# EAGLE board umod4 (EAGLE 7.6.0)
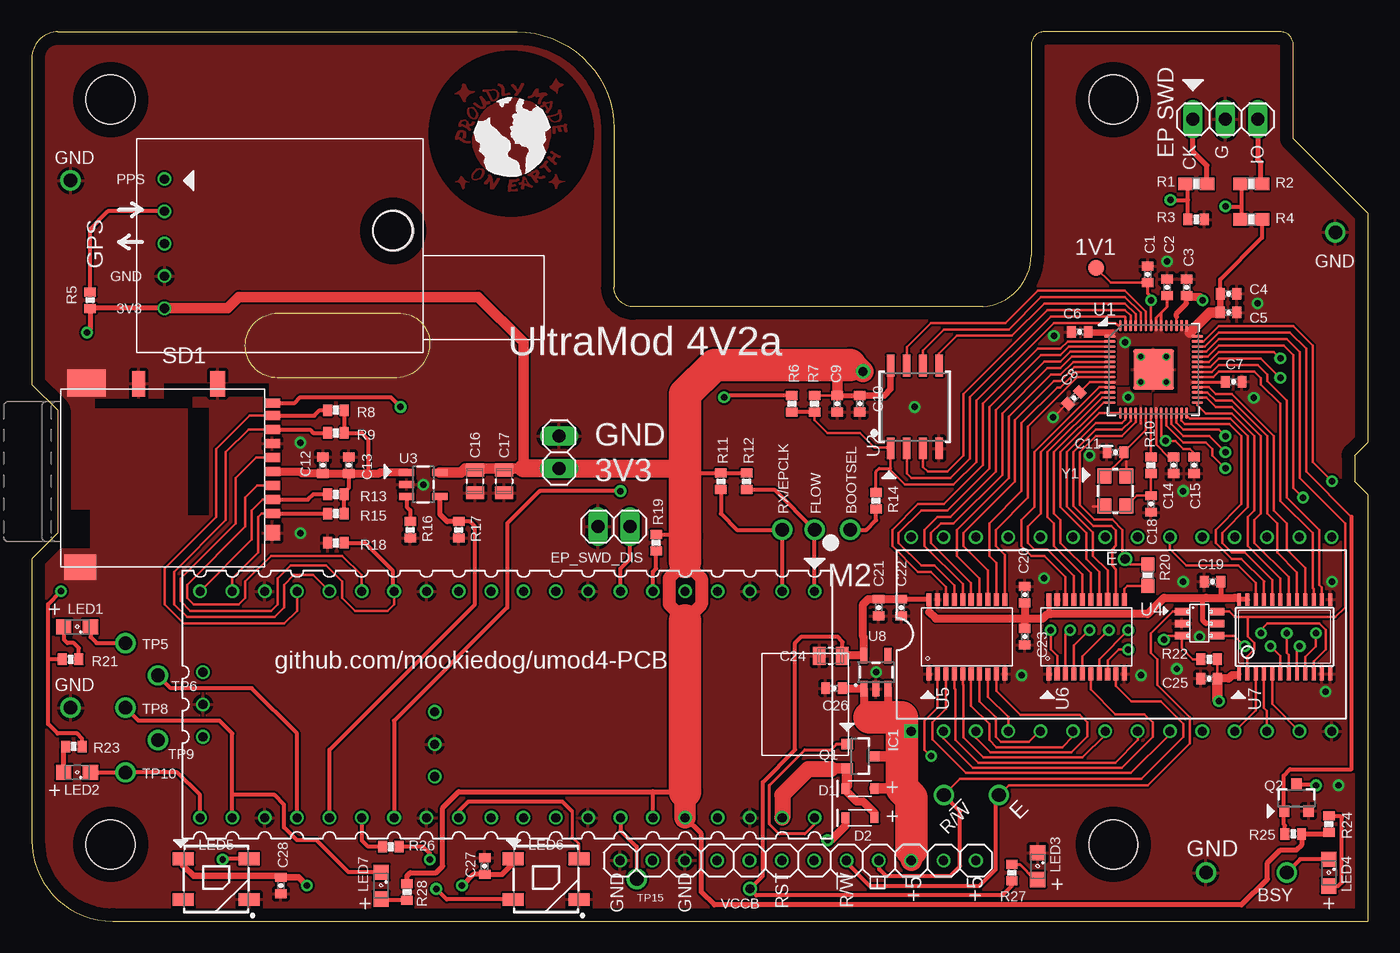
[diagram p8: board, top side]
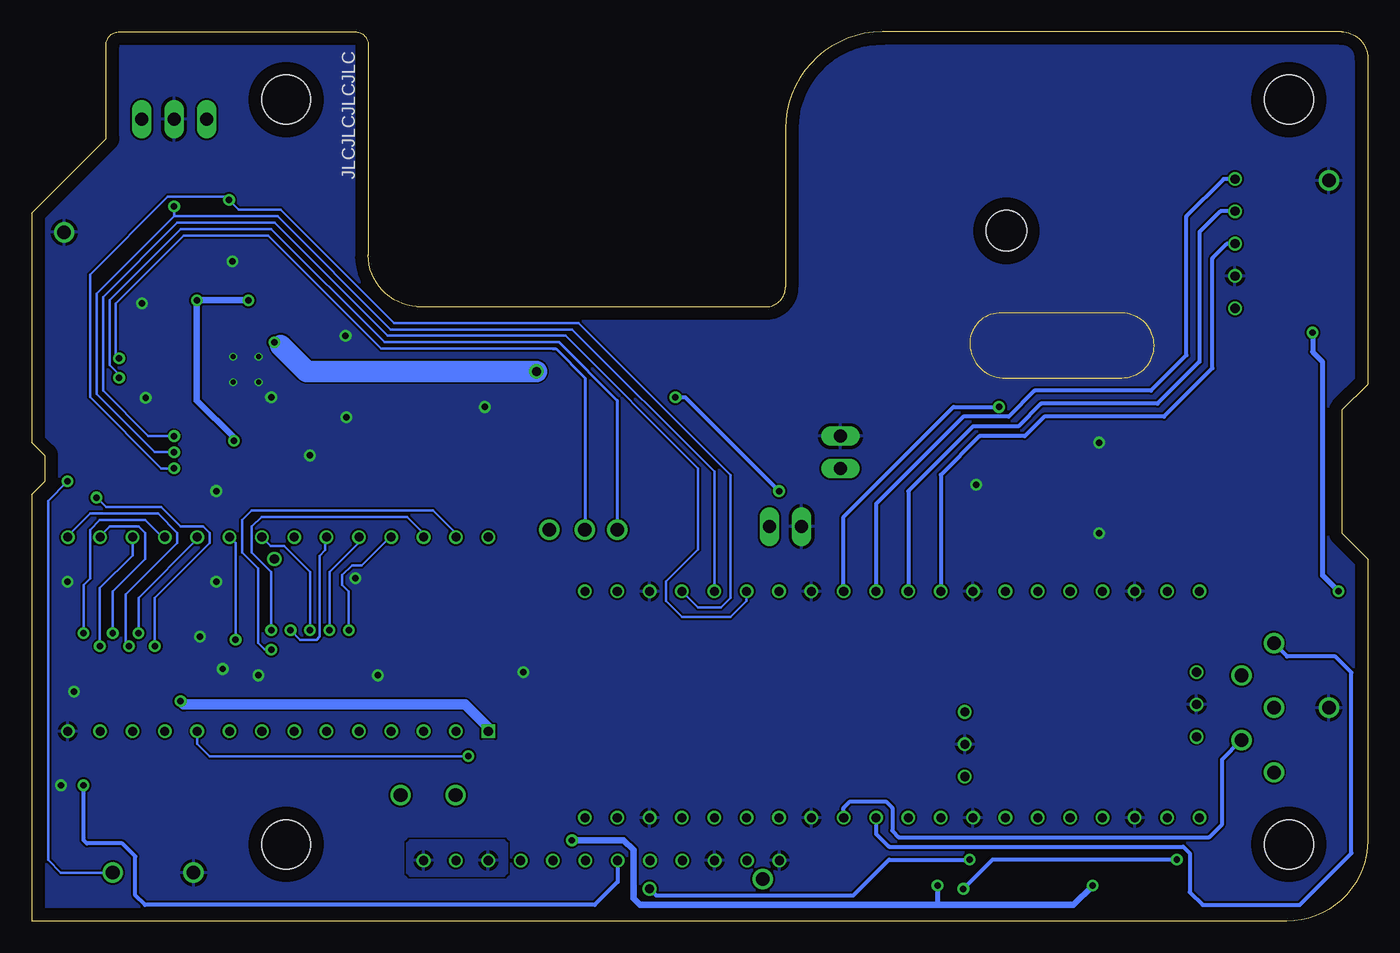
[diagram p9: board, bottom side, seen from below]

Size 104.9 x 69.85 mm. Coordinates in mm from the lower left corner, seen from the top.
Outline: 103.89,36.58 103.89,34.54 104.9,33.53 104.9,0 6.36,0 arc-90 0,6.36 0,28.45 2.03,30.48 2.03,40.13 0,42.16 0,67.8 arc-90 2.05,69.85 38.1,69.85 arc-90 45.72,62.23 45.72,49.78 arc90 47.24,48.26 74.68,48.26 arc86 78.49,52.32 78.49,68.83 arc-90 79.5,69.85 98.04,69.85 arc-90 99.06,68.83 99.06,61.47 104.9,55.63 104.9,37.59 103.89,36.58
Copper layers (1*16): Top 0.035mm / dielectric 1.5mm / Bottom 0.035mm
Design rules "default *": minimum track width 6mil, minimum drill 12mil, track to track 6mil, track to pad 6mil, pad to pad 6mil, via to via 6mil, smd to smd 6mil, copper to edge 40mil, drill to drill 8mil, minimum pad ring 4mil, minimum via ring 8mil, stop-mask expansion 5mil, vias tented up to drill 20mil, thermal gap 10mil
Holes 3.86 mm at 84.93,6.03 6.19,6.03 84.93,64.53 6.19,64.53
Holes 3.17 mm at 28.37,54.23
tRestrict: area 33.8,62.5 to 34.1,62.8; area 34.4,63.2 to 34.9,63.8; area 35.9,64.6 to 36.5,65.2; area 40.4,63.9 to 40.7,64.2; area 40.7,62.9 to 41.4,63.3; area 38.7,58 to 38.9,58.2; area 34.7,58.3 to 35.3,59; area 31.3,55.5 to 44,68.2
Milling: 6 lines

## Footprints (pad centres in the part's own frame; a part is rotated, then mirrored left to right if it is on the bottom)
B1,27 = smd 1.27 x 1.27: TP 0,0
0402-CAP = smd 0.7 x 0.9: 1 -0.65,0; 2 0.65,0
SMD-0805 = smd 1 x 1.4: 1 -0.9,0; 2 0.9,0
SOD-323 = smd 0.63 x 0.83: A 1.15,0; C -1.15,0
DIL28-6 = drill 0.711 square: 1 -16.51,-7.62 | drill 0.711: 2 -13.97,-7.62; 3 -11.43,-7.62; 4 -8.89,-7.62; 5 -6.35,-7.62; 6 -3.81,-7.62; 7 -1.27,-7.62; 8 1.27,-7.62; 9 3.81,-7.62; 10 6.35,-7.62; 11 8.89,-7.62; 12 11.43,-7.62; 13 13.97,-7.62; 14 16.51,-7.62; 15 16.51,7.62; 16 13.97,7.62; 17 11.43,7.62; 18 8.89,7.62; 19 6.35,7.62; 20 3.81,7.62; 21 1.27,7.62; 22 -1.27,7.62; 23 -3.81,7.62; 24 -6.35,7.62; 25 -8.89,7.62; 26 -11.43,7.62; 27 -13.97,7.62; 28 -16.51,7.62
1X03 = drill 1.016 long: 1 -2.54,0; 2 0,0; 3 2.54,0
1X02 = drill 1.016 long: 1 -1.27,0; 2 1.27,0
1X12 = drill 0.711: 1 -13.97,0; 2 -11.43,0; 3 -8.89,0; 4 -6.35,0; 5 -3.81,0; 6 -1.27,0; 7 1.27,0; 8 3.81,0; 9 6.35,0; 10 8.89,0; 11 11.43,0; 12 13.97,0
SML0805 = smd 1.2 x 1.2: A 1.05,0; C -1.05,0
WS2812B = smd 1.651 x 1: 1 2.577,-1.6; 2 2.577,1.6; 3 -2.577,1.6; 4 -2.577,-1.6
GPS-MODULE-DS = drill 0.711: 1 20.32,3.175; 2 20.32,5.715; 3 20.32,8.255; 4 20.32,10.795; 5 20.32,13.335
PICO-TH = drill 0.711: 1 -8.89,24.13; 2 -8.89,21.59; 3 -8.89,19.05; 4 -8.89,16.51; 5 -8.89,13.97; 6 -8.89,11.43; 7 -8.89,8.89; 8 -8.89,6.35; 9 -8.89,3.81; 10 -8.89,1.27; 11 -8.89,-1.27; 12 -8.89,-3.81; 13 -8.89,-6.35; 14 -8.89,-8.89; 15 -8.89,-11.43; 16 -8.89,-13.97; 17 -8.89,-16.51; 18 -8.89,-19.05; 19 -8.89,-21.59; 20 -8.89,-24.13; 21 8.89,-24.13; 22 8.89,-21.59; 23 8.89,-19.05; 24 8.89,-16.51; 25 8.89,-13.97; 26 8.89,-11.43; 27 8.89,-8.89; 28 8.89,-6.35; 29 8.89,-3.81; 30 8.89,-1.27; 31 8.89,1.27; 32 8.89,3.81; 33 8.89,6.35; 34 8.89,8.89; 35 8.89,11.43; 36 8.89,13.97; 37 8.89,16.51; 38 8.89,19.05; 39 8.89,21.59; 40 8.89,24.13; 41 -2.54,-23.9; 42 0,-23.9; 43 2.54,-23.9; 44 0.584,-5.7; 45 3.124,-5.7; 46 5.664,-5.7
SOT23 = smd 0.8 x 0.9: D 0,1.1; G -0.95,-1; S 0.95,-1
SOT23-3 = smd 0.8 x 0.9: 1 -0.95,-1; 2 0.95,-1; 3 0,1.1
0603-RES = smd 1.1 x 1: 1 -0.85,0; 2 0.85,0
0402-RES = smd 0.7 x 0.9: 1 -0.65,0; 2 0.65,0
DM3AT = smd 0.7 x 1.2: 1 3.3,0.6; 2 2.2,0.6; 3 1.1,0.6; 4 0,0.6; 5 -1.1,0.6; 6 -2.2,0.6; 7 -3.3,0.6; 8 -4.4,0.6; B -5.4,0.6 | smd 2 x 1: A -6.9,-9.9 | smd 2 x 1.2: GND1 -6.9,-3.7 | smd 2.1 x 3: GND2 -6.95,-14 | smd 2 x 2.5: GND3 7.5,-14.5 | smd 1.2 x 1.2: GND4 4.8,0.6
KEYSTONE-1035 = drill 1.067: P$1 0,0
RP2040-QFN56 = smd 0.875 x 0.2: 1 -3.438,2.6; 2 -3.438,2.2; 3 -3.438,1.8; 4 -3.438,1.4; 5 -3.438,1; 6 -3.438,0.6; 7 -3.438,0.2; 8 -3.438,-0.2; 9 -3.438,-0.6; 10 -3.438,-1; 11 -3.438,-1.4; 12 -3.438,-1.8; 13 -3.438,-2.2; 14 -3.438,-2.6; 29 3.438,-2.6; 30 3.438,-2.2; 31 3.438,-1.8; 32 3.438,-1.4; 33 3.438,-1; 34 3.438,-0.6; 35 3.438,-0.2; 36 3.438,0.2; 37 3.438,0.6; 38 3.438,1; 39 3.438,1.4; 40 3.438,1.8; 41 3.438,2.2; 42 3.438,2.6 | smd 0.2 x 0.875: 15 -2.6,-3.438; 16 -2.2,-3.438; 17 -1.8,-3.438; 18 -1.4,-3.438; 19 -1,-3.438; 20 -0.6,-3.438; 21 -0.2,-3.438; 22 0.2,-3.438; 23 0.6,-3.438; 24 1,-3.438; 25 1.4,-3.438; 26 1.8,-3.438; 27 2.2,-3.438; 28 2.6,-3.438; 43 2.6,3.438; 44 2.2,3.438; 45 1.8,3.438; 46 1.4,3.438; 47 1,3.438; 48 0.6,3.438; 49 0.2,3.438; 50 -0.2,3.438; 51 -0.6,3.438; 52 -1,3.438; 53 -1.4,3.438; 54 -1.8,3.438; 55 -2.2,3.438; 56 -2.6,3.438 | smd 3.2 x 3.2: 57 0,0 | drill 0.4: GND@1 -1,1; GND@2 1,1; GND@3 1,-1; GND@4 -1,-1
SOIC-8 = smd 0.61 x 1.702: 1 -1.905,-3.251; 2 -0.635,-3.251; 3 0.635,-3.251; 4 1.905,-3.251; 5 1.905,3.251; 6 0.635,3.251; 7 -0.635,3.251; 8 -1.905,3.251
SOT23-5 = smd 0.55 x 1.2: 1 -0.95,-1.3; 2 0,-1.3; 3 0.95,-1.3; 4 0.95,1.3; 5 -0.95,1.3
SOT23-6 = smd 1.1 x 0.6: 1 -1.4,0.95; 2 -1.4,0; 3 -1.4,-0.95; 4 1.4,-0.95; 5 1.4,0; 6 1.4,0.95
TSSOP-20 = smd 1 x 0.4: 1 -2.937,2.693; 2 -2.937,2.032; 3 -2.937,1.372; 4 -2.937,0.712; 5 -2.937,0.051; 6 -2.937,-0.609; 7 -2.937,-1.27; 8 -2.943,-1.93; 9 -2.937,-2.59; 10 -2.937,-3.251; 11 2.905,-3.251; 12 2.905,-2.59; 13 2.911,-1.93; 14 2.905,-1.27; 15 2.905,-0.609; 16 2.905,0.051; 17 2.905,0.712; 18 2.905,1.372; 19 2.905,2.032; 20 2.905,2.693
TSSOP-24 = smd 0.305 x 0.991: 1 -3.493,-2.935; 2 -2.842,-2.935; 3 -2.192,-2.935; 4 -1.542,-2.935; 5 -0.892,-2.935; 6 -0.242,-2.935; 7 0.407,-2.935; 8 1.058,-2.935; 9 1.708,-2.935; 10 2.357,-2.935; 11 3.007,-2.935; 12 3.658,-2.935; 13 3.658,2.9; 14 3.007,2.9; 15 2.357,2.9; 16 1.708,2.9; 17 1.058,2.9; 18 0.407,2.9; 19 -0.242,2.9; 20 -0.892,2.9; 21 -1.542,2.9; 22 -2.192,2.9; 23 -2.842,2.9; 24 -3.493,2.9
CRYSTAL-SMD-3.2X2.5MM = smd 1.2 x 1.1: 1 -1.175,-0.875; 2 1.175,-0.875; 3 1.175,0.875; 4 -1.175,0.875

## Placement (x,y rotation side)
1V1  TPB1,27  [B1,27]  83.57,51.31 0 top
C1  100n/16V/X7R  [0402-CAP]  87.63,50.8 90 top
C2  100n/16V/X7R  [0402-CAP]  89.15,49.78 90 top
C3  2u2/6.3V/X5R  [0402-CAP]  90.68,49.78 90 top
C4  2u2/6.3V/X5R  [0402-CAP]  93.98,49.28 0 top
C5  100n/16V/X7R  [0402-CAP]  93.98,47.8 0 top
C6  100n/16V/X7R  [0402-CAP]  82.3,46.28 180 top
C7  100n/16V/X7R  [0402-CAP]  94.39,42.37 0 top
C8  100n/16V/X7R  [0402-CAP]  81.84,41.1 225 top
C9  100n/16V/X7R  [0402-CAP]  63.25,40.64 270 top
C10  2u2/6.3V/X5R  [0402-CAP]  65.02,40.64 270 top
C11  33p/6.3V/COG  [0402-CAP]  85.09,36.83 0 top
C12  100n/16V/X7R  [0402-CAP]  22.86,35.81 90 top
C13  4u7/10V/X5R  [0402-CAP]  24.89,35.81 90 top
C14  100n/16V/X7R  [0402-CAP]  89.66,35.81 270 top
C15  100n/16V/X7R  [0402-CAP]  91.28,35.81 270 top
C16  10u/25V/X5R  [SMD-0805]  34.8,34.54 270 top
C17  10u/25V/X5R  [SMD-0805]  37.08,34.54 270 top
C18  33p/6.3V/COG  [0402-CAP]  87.88,32.77 90 top
C19  100n/16V/X7R  [0402-CAP]  92.71,26.67 180 top
C20  100n/16V/X7R  [0402-CAP]  77.98,25.65 90 top
C21  1u/25V/X5R  [0402-CAP]  66.5,24.64 270 top
C22  100n/16V/X7R  [0402-CAP]  68.28,24.64 270 top
C23  1u/25V/X5R  [0402-CAP]  77.98,22.35 270 top
C24  10u/25V/X5R  [SMD-0805]  62.74,20.83 180 top
C25  100n/16V/X7R  [0402-CAP]  92.46,19.05 180 top
C26  4u7/10V/X5R  [0402-CAP]  62.99,18.29 180 top
C27  100n/16V/X7R  [0402-CAP]  35.56,4.32 90 top
C28  100n/16V/X7R  [0402-CAP]  19.56,2.79 270 top
D1  1N5819WS  [SOD-323]  65.02,10.41 0 top
D2  1N5819WS  [SOD-323]  65.02,8.13 0 top
IC1  27C256-FEED-THRU  [DIL28-6]  85.57,22.54 0 top
JP1  [1X03]  93.73,62.99 0 top
JP2  [1X02]  41.4,36.83 90 top
JP3  [1X02]  45.72,30.99 180 top
JP4  PINHD-1X12  [1X12]  60.17,4.76 0 top
LED1  KT-0805G  [SML0805]  3.56,23.11 180 top
LED2  KT-0805Y  [SML0805]  3.56,11.68 180 top
LED3  KT-0805Y  [SML0805]  78.99,4.32 270 top
LED4  KT-0805G  [SML0805]  101.85,3.81 270 top
LED5  WS2812  [WS2812B]  14.48,3.3 180 top
LED6  WS2812  [WS2812B]  40.39,3.3 180 top
LED7  NCD0805R1  [SML0805]  27.43,2.79 270 top
M1  Generic single-sided NEO-8  [GPS-MODULE-DS]  30.73,61.47 180 top
M2  RPi Pico W  [PICO-TH]  37.34,17.02 270 top
Q1  DNP/SI2301CDS  [SOT23]  65.02,12.95 270 top
Q2  SS8050  [SOT23-3]  99.31,9.65 0 top
R1  100R  [0603-RES]  91.44,57.91 0 top
R2  100R  [0603-RES]  95.76,57.91 0 top
R3  10K  [0402-RES]  91.44,55.12 0 top
R4  4K7  [0603-RES]  95.76,55.12 180 top
R5  10K  [0402-RES]  4.57,48.77 270 top
R6  1K  [0402-RES]  59.69,40.64 90 top
R7  10K  [0402-RES]  61.47,40.64 90 top
R8  10K  [0402-RES]  23.88,40.13 0 top
R9  10K  [0402-RES]  23.88,38.35 0 top
R10  1K  [0402-RES]  87.88,35.81 270 top
R11  10K  [0402-RES]  54.1,34.54 270 top
R12  10K  [0402-RES]  56.13,34.54 270 top
R13  10K  [0402-RES]  23.88,33.53 0 top
R14  1K  [0402-RES]  66.29,33.02 90 top
R15  10K  [0402-RES]  23.88,32 0 top
R16  10K  [0402-RES]  29.72,30.73 270 top
R17  10K  [0402-RES]  33.53,30.73 270 top
R18  10K  [0402-RES]  23.88,29.72 180 top
R19  10K  [0402-RES]  49.02,29.72 90 top
R20  100R  [0603-RES]  87.63,27.18 270 top
R21  470R  [0402-RES]  3.05,20.57 0 top
R22  10K  [0402-RES]  92.46,20.57 0 top
R23  470R  [0402-RES]  3.3,13.72 180 top
R24  470R  [0402-RES]  101.85,7.62 90 top
R25  10K  [0402-RES]  99.06,6.86 0 top
R26  10K  [0402-RES]  28.19,5.84 180 top
R27  1K  [0402-RES]  76.96,3.81 90 top
R28  470R  [0402-RES]  29.46,2.29 270 top
SD1  DM3AT-SF-PEJM5  [DM3AT]  18.29,35.31 270 top
TP1  1035  [KEYSTONE-1035]  102.36,54.1 0 top
TP2  1035  [KEYSTONE-1035]  58.93,30.73 0 top
TP3  1035  [KEYSTONE-1035]  61.47,30.73 0 top
TP4  1035  [KEYSTONE-1035]  64.26,30.73 0 top
TP5  1035  [KEYSTONE-1035]  7.37,21.84 0 top
TP6  1035  [KEYSTONE-1035]  9.91,19.3 0 top
TP7  1035  [KEYSTONE-1035]  3.05,16.76 0 top
TP8  1035  [KEYSTONE-1035]  7.37,16.76 90 top
TP9  1035  [KEYSTONE-1035]  9.91,14.22 0 top
TP10  1035  [KEYSTONE-1035]  7.37,11.68 0 top
TP11  1035  [KEYSTONE-1035]  71.63,9.91 0 top
TP12  1035  [KEYSTONE-1035]  75.95,9.91 0 top
TP13  1035  [KEYSTONE-1035]  92.2,3.81 0 top
TP14  1035  [KEYSTONE-1035]  98.55,3.81 180 top
TP15  1035  [KEYSTONE-1035]  47.5,3.3 0 top
TP16  1035  [KEYSTONE-1035]  3.05,58.17 0 top
U1  RP2040  [RP2040-QFN56]  88.09,43.33 0 top
U2  W25Q128JVSIQ  [SOIC-8]  69.34,40.39 0 top
U3  SY6280AAC  [SOT23-5]  30.73,34.29 270 top
U4  74LVC2G04  [SOT23-6]  91.69,23.37 0 top
U5  74LVC541  [TSSOP-20]  73.15,22.35 90 top
U6  74LVC541  [TSSOP-20]  82.55,22.35 90 top
U7  74LVC4245  [TSSOP-24]  98.3,22.35 0 top
U8  TLV75733P  [SOT23-5]  66.29,19.56 0 top
Y1  12MHz  [CRYSTAL-SMD-3.2X2.5MM]  85.09,33.78 90 top

## Tracks (layer width: path | path; a pad name or v marks a point on that pad's centre or on a via)
1.0V  (via drill 0.51)
  Top 0.203: U1.23 88.69,38.06 v89.03,37.72 89.79,37.72 90.42,37.08 90.93,37.08 91.19,36.83 91.19,36.56 C15.1 | U1.45 89.89,47.47 | U1.50 87.89,48.51 87.88,48.51 v87.88,48.77 | 85.74,50.15 C1.1 84.72,50.15 1V1.TP
  Top 0.254: v87.88,48.77 87.88,49.02 87.63,49.28 C1.1
  Top 0.305: 90.4,48.23
  Top 0.406: 89.89,47.47 89.89,47.72 90.4,48.23 | 90.4,48.23 90.68,48.51 C3.1
  Top 0.61: v91.95,48.77 91.69,49.02 90.57,49.02 C3.1
  Bottom 0.203: 89.03,37.97 v89.03,37.72
  Bottom 0.508: v87.88,48.77 v91.95,48.77 91.95,40.89 89.03,37.97
!CARD  (via drill 0.51)
  Top 0.305: SD1.B 20.64,40.71 21.08,41.15 28.19,41.15 v28.96,40.39
  Bottom 0.305: M2.9 41.15,31.75 32.51,40.39 v28.96,40.39
!CE!_5V  (via drill 0.51)
  Top 0.203: U7.22 96.11,26.58 94.74,27.94 90.68,27.94 89.38,29.24 IC1.20 | v88.9,22.1 89.22,22.42 U4.3 90.29,21.47 91.19,20.57 R22.1
  Bottom 0.203: v88.9,22.1 88.9,29.69 IC1.20
!RESET!_5V  (via drill 0.51)
  Top 0.305: Q2.3 100.75,10.75 v100.84,10.67
  Bottom 0.305: JP4.6 58.9,3.08 60.71,1.27 96.01,1.27 96.77,2.03 96.77,5.08 97.79,6.1 100.58,6.1 100.84,6.35 v100.84,10.67
!RESET!_HC11_OUT
  Top 0.203: U1.40 92.12,45.13 93.22,46.23 98.81,46.23 100.08,44.96 100.08,35.31 103.63,31.75 | 98.3,8.84 98.3,8.72 Q2.1
  Top 0.305: 103.63,31.75 103.63,11.94 98.81,11.94 98.3,11.43 98.3,8.84 | R25.1 98.41,7.51 98.3,7.62 98.3,8.59 Q2.1
+3V3  (via drill 0.51, 0.51 pad 0.3, 0.71 pad 0.3)
  Top 0.203: U1.10 83.08,42.33 C8.1 | U1.22 88.29,37.44 89.27,36.46 C14.1 | 84.9,46.16 84.84,46.23 | C9.1 R7.2 | U1.1 84.65,46.16 84.58,46.23 | 51.45,35.19 51.31,35.05
  Top 0.254: U1.33 93.7,42.33 C7.1 | U1.48 88.69,47.79 | 88.69,47.79 89.15,48.26 C2.1 | 88.69,47.79 88.29,47.39 U1.49
  Top 0.305: C4.1 93.33,50.4 96.61,53.68 R4.1 | R19.2 51.17,30.37 51.31,30.23 | 4.59,48.13 R5.2 | M2.35 48.77,10.16 | M2.36 51.31,7.87 | R23.1 3.95,14.34 3.56,14.73 2.03,14.73 1.27,15.49 1.27,20.57 | 1.27,20.57 1.27,24.89 v2.29,25.91 | R21.1 1.27,20.57 | 51.45,35.19 R11.1 R12.1
  Top 0.406: 83,46.23 C6.1 | C9.1 C10.1 | M1.5 4.59,48.13 | R5.2 4.57,46.48 v4.32,46.23 | 51.31,10.16 48.77,10.16 33.53,10.16 32.26,8.89 32.26,4.32 31.75,3.81 29.72,3.81 29.46,3.56 R28.1 | R24.1 101.74,6.86 R25.2 99.71,5.98 99.31,5.59 98.04,5.59 97.03,4.57 97.03,3.3 95,1.27 53.59,1.27 52.58,2.29 52.58,6.86 M2.36 | 37.59,35.56 37.59,35.44 C17.1 | C16.1 34.29,35.44 34.29,35.56
  Top 0.508: 84.84,46.23 84.58,46.23 83,46.23 | C10.1 66.94,41.29 67.44,41.78 U2.8 | C4.1 C5.1
  Top 0.813: C9.1 63.25,43.69 64.26,43.69 | C5.1 92.51,47.8 90.93,46.23 | U3.5 33.72,35.24 34.04,35.56 34.29,35.56 37.59,35.56 38.61,35.56 38.61,45.47 35.05,49.02 16.26,49.02 15.37,48.13 M1.5
  Top 1.016: 51.31,28.19 52.58,26.92 52.58,24.89 51.31,23.62 50.04,24.89 50.04,26.92 51.31,28.19
  Top 1.422: 51.31,35.56 JP2.1 38.61,35.56
  Top 1.676: 64.26,43.69 64.77,43.69 v65.28,43.18 | M2.36 51.31,10.16
  Top 2.54: 64.26,43.69 53.59,43.69 51.31,41.4 51.31,35.56 51.31,35.05 51.31,30.23 51.31,28.19 | 51.31,10.16 51.31,23.62
  Bottom 0.203: v85.85,45.47 85.85,45.72 85.34,45.21
  Bottom 0.406: v4.32,46.23 4.32,44.7 3.56,43.94 3.56,27.18 v2.29,25.91
  Bottom 1.676: v65.28,43.18 83.31,43.18 85.34,45.21
  pour Top (no thermals): 84.84,46.48 91.34,46.48 91.34,40.08 88.14,40.08 88.14,41.4 90.04,41.4 90.04,45.21 86.11,45.21 86.11,42.16 84.84,42.16
+5_ECU  (via drill 0.51 pad 0.3)
  Top 0.203: C25.1 R22.2 | IC1.1 68.39,14.92 68.33,14.99
  Top 0.406: U7.1 94.6,19.42 94.49,19.3
  Top 0.508: C26.1 63.67,18.26
  Top 0.61: 94.49,19.3 94.23,19.3 93.98,19.05 C25.1 | 65.79,16 65.34,16.44 U8.1 63.67,18.26 | U8.3 67.24,16.07 67.31,16
  Top 0.813: D1.A 68.33,10.41 | Q1.D 68.33,12.95 | C25.1 93.11,17.38 v93.22,17.27
  Top 1.676: 69.09,5.59 69.09,4.79 JP4.10
  Top 2.54: 65.79,16 67.31,16 68.33,16 68.33,14.99 68.33,12.95 68.33,10.41 69.06,9.68 69.06,5.62 69.09,5.59
  Bottom 0.406: IC1.1 69.06,15.21
  Bottom 0.813: 69.06,15.21 70.87,17.02 92.96,17.02 v93.22,17.27
  pour Bottom: 67.56,3.81 67.56,6.1 67.82,6.35 75.18,6.35 75.44,6.1 75.44,3.81 75.18,3.56 67.82,3.56
A0_5V  (via drill 0.51 pad 0.3)
  Top 0.203: U5.2 71.12,16.76 70.1,15.75 70.1,13.46 v70.61,12.95
  Bottom 0.203: IC1.10 91.92,13.94 90.93,12.95 v70.61,12.95
A1_5V
  Top 0.203: U5.3 71.78,16.66 70.71,15.6 70.71,14.28 73.36,11.63 86.31,11.63 89.15,14.48 89.15,14.7 IC1.9
A2_5V
  Top 0.203: U5.4 72.44,18.29 72.54,18.19 72.54,14.22 74.32,12.45 85.09,12.45 86.87,14.22 86.87,14.89 IC1.8
A3_5V
  Top 0.203: IC1.7 84.3,14.65 82.5,12.85 74.73,12.85 73.15,14.43 73.15,18.54 73.1,18.59 U5.5
A4_5V
  Top 0.203: IC1.6 81.76,14.5 80.92,13.66 75.74,13.66 75.18,14.22 75.18,15.49 73.76,16.92 U5.6
A5_5V
  Top 0.203: IC1.5 79.13,14.92 78.28,14.07 76.1,14.07 75.69,14.48 75.69,16 74.42,17.27 U5.7
A6_5V
  Top 0.203: U5.8 75.08,17.63 76.68,16.03 IC1.4
A7_5V
  Top 0.203: IC1.3 74.14,14.41 75.29,13.26 81.64,13.26 82.91,14.53 82.91,15.6 82.3,16.2 77.62,16.2 75.74,18.09 U5.9
A8_5V  (via drill 0.51 pad 0.3)
  Top 0.203: U6.2 80.52,20.83 80.01,21.34 v80.01,22.86
  Bottom 0.203: IC1.25 76.77,30.16 78.99,27.94 79.76,27.94 80.52,27.18 80.52,26.42 80.01,25.91 v80.01,22.86
A9_5V  (via drill 0.51 pad 0.3)
  Top 0.203: U6.3 81.18,22.5 v81.53,22.86
  Bottom 0.203: IC1.24 79.22,29.75 81.53,27.43 v81.53,22.86
A10_5V  (via drill 0.51 pad 0.3)
  Top 0.203: U6.4 81.84,21.64 v83.06,22.86
  Bottom 0.203: IC1.21 86.14,29.46 85.09,29.46 83.06,27.43 v83.06,22.86
A11_5V  (via drill 0.51 pad 0.3)
  Top 0.203: U6.5 82.5,20.78 v84.58,22.86
  Bottom 0.203: IC1.23 81.85,30.16 81.85,29.15 82.3,28.7 82.3,22.35 82.55,22.1 83.82,22.1 v84.58,22.86
A12_5V
  Top 0.203: IC1.2 71.6,14.36 73.91,12.04 85.6,12.04 88.04,14.48 88.04,15.6 87.38,16.26 85.09,16.26 83.16,18.19 U6.6
A13_5V  (via drill 0.51 pad 0.3)
  Top 0.203: U6.7 83.82,20.57 v86.11,22.86
  Bottom 0.203: IC1.26 74.14,30.45 75.44,31.75 86.87,31.75 87.63,30.99 87.63,28.96 86.11,27.43 v86.11,22.86
A14_5V  (via drill 0.51 pad 0.3)
  Top 0.203: U6.8 84.48,20.47 85.34,21.34 v86.11,21.34
  Bottom 0.203: IC1.27 71.6,30.45 73.41,32.26 87.63,32.26 88.39,31.5 88.39,28.96 87.12,27.69 87.12,21.84 86.61,21.34 v86.11,21.34
CE  (via drill 0.51)
  Top 0.203: U1.38 92.34,44.33 93.22,45.21 98.3,45.21 99.06,44.45 99.06,34.04 v99.82,33.27 | v95.25,21.59 94.42,22.42 U4.4
  Bottom 0.203: v95.25,21.59 95.25,25.4 90.93,29.72 90.93,30.48 91.44,30.99 93.22,30.99 94.74,32.51 99.06,32.51 v99.82,33.27
D0
  Top 0.203: U1.27 90.29,39.3 90.53,39.06 94.03,39.06 95,38.1 95,32.77 92.96,30.73 92.96,29.72 94.23,28.45 95,28.45 96.77,26.67 96.75,26.65 U7.21
D0_5V
  Top 0.203: U7.3 96.11,16.57 IC1.11
D1
  Top 0.203: U1.28 90.69,39.72 90.93,39.47 94.13,39.47 95.5,38.1 95.5,32.51 93.47,30.48 93.47,29.72 94.23,28.96 95.25,28.96 97.41,26.8 U7.20
D1_5V
  Top 0.203: U7.4 96.75,16.75 97,16.5 IC1.12
D2
  Top 0.203: U1.29 91.53,40.55 92.2,39.88 94.23,39.88 96.01,38.1 96.01,32.26 95.5,31.75 95.5,29.46 98.06,26.91 U7.19
D2_5V
  Top 0.203: IC1.13 97.41,17.05 U7.5
D3
  Top 0.203: U1.30 92.22,41.13 92.96,40.39 94.23,40.39 96.52,38.1 96.52,32 96.01,31.5 96.01,29.72 98.71,27.02 U7.18
D3_5V  (via drill 0.51)
  Top 0.203: U7.6 98.04,19.43 98.04,20.83 v97.28,21.59
  Bottom 0.203: IC1.15 102.08,30.26 100.33,32 95,32 93.47,30.48 93.47,29.72 97.54,25.65 97.54,21.84 v97.28,21.59
D4
  Top 0.203: U1.31 92.33,41.53 92.96,40.89 94.23,40.89 97.03,38.1 97.03,32 97.79,31.24 97.79,28.96 99.36,27.39 U7.17
D4_5V  (via drill 0.51)
  Top 0.203: U7.7 98.71,20.93 98.55,21.08 v98.55,22.61
  Bottom 0.203: IC1.16 99.54,30.26 98.81,30.99 96.52,30.99 96.01,30.48 96.01,28.45 98.55,25.91 v98.55,22.61
D5
  Top 0.203: U1.32 92.43,41.93 92.96,41.4 94.23,41.4 97.54,38.1 97.54,32.26 98.55,31.24 98.55,29.21 100,27.76 U7.16
D5_5V  (via drill 0.51)
  Top 0.203: U7.8 99.36,21.38 v99.57,21.59
  Bottom 0.203: IC1.17 97,28.73 99.57,26.16 v99.57,21.59
D6
  Top 0.203: U1.34 92.77,42.73 93.22,43.18 96.01,43.18 96.52,42.67 96.52,42.16 98.04,40.64 98.04,33.02 100.58,30.48 100.58,26.16 100.66,26.09 U7.15
D6_5V  (via drill 0.51)
  Top 0.203: U7.9 100,20.76 100.84,21.59 v100.84,22.61
  Bottom 0.203: IC1.18 94.68,30.16 96.01,31.5 99.57,31.5 100.33,30.73 100.33,26.92 100.84,26.42 v100.84,22.61
D7
  Top 0.203: U1.35 92.66,43.13 93.22,43.69 96.27,43.69 97.03,42.93 97.03,42.42 98.55,40.89 98.55,33.27 101.09,30.73 101.09,26.42 101.31,26.2 U7.14
D7_5V  (via drill 0.51)
  Top 0.203: v96.52,22.61 96.52,22.86 97.03,23.37 101.09,23.37 101.6,22.86 101.6,21.34 100.66,20.39 U7.10
  Bottom 0.203: IC1.19 91.92,30 96.52,25.4 v96.52,22.61
DAT1
  Top 0.203: M2.17 20.83,24.38 19.81,23.37 11.94,23.37 10.41,24.89 10.41,27.69 14.48,31.75 14.48,37.08 17.1,39.71 SD1.8
  Top 0.305: SD1.8 22.18,39.71 22.61,40.13 R8.1
DAT2
  Top 0.203: M2.19 15.75,26.92 17.78,28.96 17.78,31.75 18.04,32.01 SD1.1 | R15.1
  Top 0.305: 23.19,32.04 R15.1 | SD1.1 R15.1
DBG_BSY  (via drill 0.51)
  Top 0.203: U1.41 92.01,45.53 93.22,46.74 99.06,46.74 100.58,45.21 100.58,36.07 v102.11,34.54
  Top 0.305: LED4.C 99.6,4.86 TP14.P$1
  Bottom 0.203: v102.11,34.54 103.63,33.02 103.63,4.83 102.62,3.81 TP14.P$1
DISK_BSY
  Top 0.305: LED1.C 4.61,22.32 5.08,21.84 TP5.P$1
  Bottom 0.305: M2.31 38.61,6.86 37.59,5.84 14.48,5.84 13.97,5.33 13.97,2.29 12.95,1.27 5.33,1.27 1.27,5.33 1.27,19.52 2.54,20.79 6.32,20.79 TP5.P$1
E  (via drill 0.71)
  Top 0.203: U1.18 86.69,39.19 85.6,38.1 83.57,38.1 82.3,36.83 82.3,32.67 83.42,31.55 84.84,31.55 85.65,30.73 85.65,28.65 v85.85,28.45 | 85.96,28.34 v85.85,28.45 | R20.1 86.27,28.03 v85.85,28.45
E_5V
  Top 0.203: 66.55,4.79 JP4.9 66.55,4.73 | U6.9 85.14,18.49 86.36,17.27 88.65,17.27 90.42,15.49 90.42,14.48 87.12,11.18 72.9,11.18 TP11.P$1
  Top 0.305: 66.55,4.73 66.55,4.06 67.06,3.56 72.14,3.56 72.9,4.32 72.9,8.64 TP11.P$1
EN_VDD_SD
  Top 0.305: M2.25 23.37,13.46 34.8,24.89 34.8,30.99 34.4,31.38 R17.1
  Top 0.406: U3.4 32.03,31.97 32.62,31.38 R17.1
EP_BOOTSEL  (via drill 0.51)
  Top 0.305: R6.2 54.5,41.29 v54.36,41.15 | v46.23,33.78 39.88,33.78 37.34,31.24 37.34,24.64 28.45,15.75 M2.27
  Bottom 0.305: v54.36,41.15 53.59,41.15 v46.23,33.78
EP_RUN  (via drill 0.51 pad 0.3)
  Top 0.203: U1.26 89.89,39.15 90.42,38.61 93.22,38.61 v93.73,38.1
  Top 0.305: M2.6 48.77,27.43 49.02,27.69 R19.1
  Bottom 0.203: M2.6 48.77,25.15 50.04,23.88 53.85,23.88 55.12,25.15 55.12,26.67 52.58,29.21 52.58,35.56 62.99,45.97 76.96,45.97 85.85,54.86 93.47,54.86 99.31,49.02 99.31,41.66 95.76,38.1 v93.73,38.1
EP_SWD_DIS
  Top 0.305: M2.7 46.23,27.69 46.99,28.45 JP3.1
EXT_RP_SWCLK
  Top 0.406: JP1.1 91.19,60.45 92.29,59.35 R1.2
EXT_RP_SWD
  Top 0.406: JP1.3 96.27,59.83 96.52,59.58 96.52,57.91 R2.2
GND  (via drill 0.51, 0.51 pad 0.3)
  Top 0.203: U1.19 87.09,39.08 | U1.GND@4 U1.57 | 83.33,32.58 83.93,32.58 | 85.95,36.09 85.95,35.44 | C8.2 81.28,40.64 v80.21,39.57
  other vias: 83.06,36.58 101.6,18.03 95.96,41.1 69.34,40.39 90.42,33.78 89.15,51.82 80.26,45.97 96.27,48.51 86.11,41.15 89.92,19.81 21.08,37.59 90.42,26.67 79.5,26.92 77.72,19.3 87.12,19.3 91.69,22.35 102.11,26.67 66.29,19.56 102.62,10.67 21.08,30.48 30.73,34.29
  pour Bottom (rank 3): 104.9,0 104.9,69.85 0,69.85 0,0
  pour Top (rank 2): 0,69.85 104.9,69.85 104.9,0 0,0
GPS_PPS
  Bottom 0.305: M2.10 38.61,32.77 31.75,39.62 28.19,39.62 26.16,41.66 17.02,41.66 14.22,44.45 14.22,55.37 11.3,58.29 M1.1
IO0
  Top 0.203: U5.18 71.78,26.26 70.61,27.43 69.6,27.43 67.56,29.46 67.56,30.73 69.6,32.77 71.63,32.77 74.68,35.81 74.68,40.64 78.99,44.96 80.77,44.96 81.35,45.53 U1.2
IO1
  Top 0.203: U5.17 72.44,26.37 70.87,27.94 69.85,27.94 68.07,29.72 68.07,30.48 69.85,32.26 71.88,32.26 75.18,35.56 75.18,40.39 79.25,44.45 80.77,44.45 81.45,45.13 U1.3
IO2
  Top 0.203: U5.16 73.1,26.47 70.1,29.46 70.1,30.73 71.12,31.75 72.14,31.75 75.69,35.31 75.69,40.13 79.5,43.94 80.77,43.94 81.56,44.73 U1.4
IO3
  Top 0.203: U5.15 73.76,26.57 70.61,29.72 70.61,30.48 71.37,31.24 72.39,31.24 76.2,35.05 76.2,39.88 79.76,43.43 80.77,43.43 81.67,44.33 U1.5
IO4
  Top 0.203: U5.14 74.42,26.92 72.64,28.7 72.64,30.73 76.71,34.8 76.71,39.62 80.01,42.93 80.77,42.93 81.78,43.93 U1.6 | U5.14
IO5
  Top 0.203: U5.13 75.08,27.53 73.15,29.46 73.15,30.48 77.22,34.54 77.22,39.37 80.26,42.42 80.77,42.42 81.89,43.53 U1.7
IO6
  Top 0.203: U5.12 75.74,28.14 75.18,28.7 75.18,31.24 77.72,33.78 77.72,39.12 80.52,41.91 80.77,41.91 81.99,43.13 U1.8
IO7
  Top 0.203: U5.11 76.4,28.75 75.69,29.46 75.69,30.73 78.23,33.27 78.23,38.86 82.1,42.73 U1.9
IO8
  Top 0.203: U1.11 83.84,41.93 78.74,36.83 78.74,32.51 77.72,31.5 77.72,29.46 78.49,28.7 79.5,28.7 81.18,27.03 U6.18
IO9
  Top 0.203: U1.12 83.95,41.53 79.25,36.83 79.25,32 78.23,30.99 78.23,29.72 78.74,29.21 79.76,29.21 81.84,27.13 U6.17
IO10
  Top 0.203: U1.13 84.06,41.13 79.76,36.83 79.76,31.75 80.26,31.24 80.26,29.46 82.5,27.23 U6.16
IO11
  Top 0.203: U6.15 83.16,27.33 80.77,29.72 80.77,31.5 80.26,32 80.26,36.83 84.17,40.73 U1.14
IO12
  Top 0.203: U1.15 83.84,39.9 80.77,36.83 80.77,32.51 82.8,30.48 82.8,28.45 83.82,27.43 U6.14 | U6.14
IO13
  Top 0.203: U1.16 85.89,39.41 85.6,39.12 83.57,39.12 81.28,36.83 81.28,32.57 83.31,30.53 83.31,28.7 84.48,27.53 U6.13
IO14
  Top 0.203: U1.17 86.29,39.3 85.6,38.61 83.57,38.61 81.79,36.83 81.79,32.62 83.37,31.04 84.78,31.04 85.14,30.68 85.14,29.52 84.84,29.21 84.84,27.94 85.14,27.64 U6.12
N$1
  Top 0.203: R10.2 C18.2 86.77,33.42 Y1.1
N$2
  Top 0.203: U1.20 87.49,38.58 C11.2 85.74,36.46 84.23,34.96 Y1.3
N$3
  Top 0.254: LED3.A 78.77,3.27 77.58,4.46 R27.2
N$4
  Top 0.305: TP4.P$1 65.53,30.73 66.29,31.5 R14.1
N$5
  Top 0.203: U1.21 R10.1
N$6
  Top 0.305: R24.2 102.73,8.27 102.87,8.13 102.87,3.05 102.58,2.76 LED4.A
N$7
  Top 0.203: U1.56 85.31,46.77 85.09,46.99 80.26,46.99 74.17,40.89 74.17,36.07 72.39,34.29 68.58,34.29 67.44,35.43 67.44,35.56 U2.1 67.33,37.13 67.26,37.21 66.17,37.21 65.02,38.35 62.48,38.35 61.47,39.37 R7.1
  Top 0.254: R14.2 66.29,35.31 66.55,35.56 67.44,35.56
  Top 0.305: R7.1 R6.1
N$8
  Top 0.203: U1.52 87.09,47.79 85.85,49.02 79.25,49.02 76.71,46.48 71.63,46.48 69.98,44.83 U2.6
N$9
  Top 0.203: U1.53 86.69,47.68 85.85,48.51 79.5,48.51 76.96,45.97 72.64,45.97 71.25,44.58 U2.5
N$10
  Top 0.203: U1.55 85.89,47.46 85.85,47.5 80.01,47.5 73.66,41.15 73.66,36.32 72.14,34.8 69.09,34.8 68.71,35.18 U2.2
N$11
  Top 0.203: U1.54 86.29,47.57 85.85,48.01 79.76,48.01 73.15,41.4 73.15,36.58 71.88,35.31 70.36,35.31 69.98,35.69 U2.3
N$12
  Top 0.203: U1.51 87.49,47.9 85.85,49.53 78.99,49.53 76.45,46.99 70.61,46.99 68.71,45.09 U2.7
N$13
  Top 0.406: LED2.A 2.51,13.57 R23.2
N$14
  Top 0.305: U3.3 29.43,32.54 29.72,32.26 R16.1
N$19  (via drill 0.51)
  Top 0.305: LED5.4 15.24,4.9 | 15.24,4.9 15.16,4.9 | v31.75,2.54 32.59,1.7 LED6.2 | v14.99,4.83 15.16,4.83 15.24,4.9
  Bottom 0.305: v14.99,4.83 29.46,4.83 v31.75,2.54
N$20
  Top 0.203: U6.11 85.8,26.11 86.02,26.33 R20.2
N$21
  Top 0.305: R21.2 3.7,21.45 3.3,21.84 2.79,21.84 2.54,22.1 2.54,23.08 LED1.A
N$22
  Top 0.305: R28.2 27.54,1.64 LED7.A
N$32
  pour Top: 41.03,59.68 41.19,59.52 41.19,59.47 41.15,59.44 41.14,59.42 41.12,59.41 41.08,59.41 41.06,59.42 41.04,59.44 40.78,59.7 40.53,59.91 40.5,59.94 40.5,59.99 40.53,60.03 40.55,60.06 40.61,60.07 40.64,60.04 40.83,59.87 40.84,59.87 40.92,60 40.92,60 40.92,60 40.92,60 41,60.11 41.01,60.18 40.8,60.31 40.76,60.33 40.75,60.38 40.77,60.42 40.8,60.46 40.85,60.47 40.88,60.45 41.45,60.11 41.48,60.08 41.5,60.04 41.47,60 41.46,59.97 41.43,59.96 41.39,59.96 41.38,59.96 41.36,59.97 41.16,60.09 41.16,60.06 41.15,60.05 41.15,60.04 41.14,60.03 41.05,59.91 40.96,59.77 40.96,59.77 40.96,59.76 40.95,59.76
N$38
  pour Top: 40.49,64.31 40.67,64.34 40.68,64.35 40.69,64.34 40.7,64.34 40.72,64.38 40.75,64.4 40.79,64.4 40.83,64.39 40.86,64.35 40.86,64.31 40.83,64.06 40.83,64.05 40.83,64.05 40.83,64.04 40.76,63.87 40.76,63.86 40.76,63.86 40.76,63.85 40.63,63.66 40.53,63.51 40.52,63.49 40.49,63.48 40.45,63.48 40.44,63.48 40.42,63.49 40.39,63.52 40.38,63.57 40.4,63.6 40.5,63.75 40.5,63.75 40.29,64.05 40.09,63.93 40.08,63.93 40.06,63.92 40.02,63.92 39.99,63.94 39.98,63.97 39.96,64 39.97,64.05 40.01,64.07 40.19,64.18 40.16,64.22 40.14,64.25 40.15,64.3 40.18,64.33 40.22,64.36 40.27,64.35 40.29,64.31 40.34,64.25 40.47,64.3 40.48,64.31 40.48,64.31
N$39
  pour Top: 39.04,64.78 39.17,64.84 39.31,64.92 39.45,65.14 39.56,65.29 39.6,65.35 39.62,65.38 39.65,65.39 39.69,65.38 39.72,65.37 39.75,65.34 39.75,65.09 39.75,65.09 39.75,65.08 39.72,64.9 39.74,64.9 39.88,65.01 39.89,65.02 39.9,65.02 39.9,65.02 40.03,65.08 40.04,65.08 40.05,65.09 40.21,65.09 40.22,65.09 40.22,65.09 40.33,65.06 40.34,65.06 40.36,65.05 40.43,64.98 40.46,64.95 40.46,64.9 40.43,64.87 40.4,64.84 40.35,64.84 40.32,64.87 40.29,64.9 40.08,64.64 39.98,64.5 39.96,64.35 39.96,64.34 39.96,64.34 39.96,64.33 39.93,64.24 39.92,64.21 39.89,64.18 39.85,64.18 39.84,64.19 39.83,64.19 39.79,64.2 39.76,64.25 39.78,64.29 39.8,64.38 39.82,64.54 39.83,64.55 39.83,64.56 39.84,64.57 39.94,64.73 39.95,64.73 39.95,64.74 39.95,64.74 40.1,64.93 40.08,64.93 39.98,64.88 39.82,64.76 39.81,64.75 39.8,64.75 39.78,64.74 39.68,64.73 39.64,64.72 39.6,64.74 39.59,64.78 39.57,64.84 39.56,64.86 39.56,64.87 39.56,64.88 39.58,65.03 39.43,64.82 39.43,64.81 39.42,64.8 39.41,64.79 39.25,64.69 39.24,64.69 39.24,64.69 39.24,64.69 39.1,64.63 39.09,64.63 39.08,64.63 39.04,64.63 39.01,64.65 38.99,64.68 38.98,64.72 39,64.77
N$40
  pour Top: 35.47,65.32 35.87,65.32 36.13,65.36 36.13,65.36 36.14,65.36 36.15,65.36 36.34,65.34 36.34,65.34 36.35,65.34 36.36,65.33 36.48,65.28 36.49,65.27 36.5,65.26 36.51,65.25 36.62,65.09 36.63,65.08 36.63,65.07 36.63,64.75 36.63,64.73 36.62,64.72 36.54,64.57 36.53,64.56 36.52,64.55 36.51,64.54 36.42,64.49 36.39,64.48 36.37,64.45 36.24,64.41 36.19,64.39 36.18,64.39 36.17,64.38 36.13,64.38 36.1,64.4 36.08,64.43 35.72,65.16 35.47,65.16 35.43,65.19 35.43,65.28
N$41
  pour Top: 34.84,64.26 35.18,64.03 35.31,63.97 35.42,63.97 35.47,64 35.48,64.05 35.45,64.17 35.31,64.48 35.2,64.67 35.18,64.7 35.19,64.75 35.23,64.77 35.26,64.8 35.31,64.79 35.33,64.76 35.72,64.34 35.77,64.31 35.78,64.31 35.78,64.36 35.82,64.4 35.91,64.4 35.94,64.36 35.94,64.25 35.93,64.22 35.91,64.21 35.87,64.17 35.85,64.16 35.84,64.15 35.82,64.15 35.75,64.15 35.73,64.15 35.71,64.15 35.7,64.16 35.62,64.21 35.61,64.22 35.61,64.22 35.6,64.24 35.6,64.23 35.6,64.22 35.6,64.22 35.6,64.22 35.64,64.06 35.65,64.05 35.65,64.03 35.64,64.02 35.61,63.95 35.58,63.91 35.57,63.89 35.53,63.86 35.49,63.82 35.48,63.81 35.46,63.81 35.28,63.81 35.27,63.81 35.26,63.82 35.11,63.88 35.1,63.89 35.1,63.89 35.09,63.89 34.75,64.13 34.71,64.16 34.71,64.21 34.73,64.24 34.76,64.28 34.81,64.29
N$50
  pour Top: 35.02,63.24 34.98,63.14 34.97,63.13 34.96,63.11 34.95,63.1 34.83,63 34.82,62.99 34.8,62.99 34.64,62.99 34.62,62.99 34.61,63 34.47,63.08 34.47,63.08 34.46,63.08 34.46,63.09 34.36,63.18 34.35,63.18 34.34,63.19 34.34,63.2 34.28,63.35 34.27,63.35 34.27,63.35 34.27,63.35 34.23,63.41 34.22,63.42 34.22,63.42 34.22,63.43 34.21,63.59 34.2,63.6 34.2,63.61 34.22,63.7 34.23,63.71 34.23,63.72 34.23,63.72 34.27,63.78 34.28,63.88 34.3,63.89 34.32,63.9 34.47,63.93 34.48,63.93 34.48,63.93 34.64,63.93 34.66,63.92 34.67,63.91 34.81,63.78 34.81,63.78 34.81,63.77 34.82,63.77 34.98,63.51 34.98,63.5 34.99,63.5 34.99,63.49 35.02,63.28 35.03,63.27 35.03,63.26
N$52
  pour Top: 33.22,65.01 33.26,65.04 33.36,65.08 33.46,65.13 33.59,65.21 33.66,65.27 33.74,65.33 33.79,65.45 33.83,65.55 33.83,65.71 33.88,65.77 33.95,65.79 34.04,65.73 34.07,65.63 34.12,65.49 34.2,65.32 34.29,65.25 34.4,65.22 34.57,65.19 34.72,65.19 34.75,65.15 34.72,65.09 34.6,65.03 34.39,64.94 34.27,64.89 34.18,64.8 34.13,64.77 34.08,64.66 34.05,64.59 34,64.52 34.02,64.44 34.05,64.37 34,64.34 33.91,64.38 33.85,64.51 33.77,64.66 33.71,64.75 33.64,64.89 33.55,64.92 33.39,64.95 33.22,64.95
N$53
  pour Top: 34.04,58 33.97,57.94 33.94,57.78 33.93,57.58 33.88,57.49 33.76,57.77 33.66,57.93 33.43,58.06 33.28,58.06 33.33,58.11 33.56,58.19 33.66,58.4 33.7,58.53 33.78,58.44 33.97,58.19 34.19,58.08 34.33,58.03
N$54
  pour Top: 34.37,61.11 34.3,61.09 34.29,61.09 34.29,61.09 34.28,61.09 34.28,61.09 34.27,61.09 34.13,61.1 34.12,61.1 34.12,61.1 34.11,61.1 33.96,61.15 33.96,61.15 33.95,61.15 33.94,61.16 33.84,61.22 33.69,61.32 33.69,61.32 33.68,61.32 33.68,61.32 33.56,61.42 33.47,61.46 33.45,61.46 33.44,61.42 33.41,61.39 33.32,61.39 33.29,61.43 33.29,61.6 33.29,61.61 33.3,61.62 33.37,61.78 33.47,62.03 33.48,62.05 33.49,62.07 33.5,62.07 33.6,62.13 33.61,62.14 33.63,62.14 33.86,62.14 33.87,62.14 33.88,62.13 34,62.05 34.02,62.04 34.03,62.03 34.04,62.01 34.06,61.96 34.06,61.95 34.06,61.94 34.06,61.65 34.06,61.63 34.06,61.63 34.02,61.54 34.01,61.5 33.96,61.48 33.92,61.5 33.88,61.51 33.86,61.56 33.87,61.6 33.9,61.67 33.9,61.91 33.9,61.93 33.82,61.98 33.66,61.98 33.61,61.95 33.52,61.72 33.51,61.72 33.51,61.72 33.51,61.72 33.47,61.62 33.5,61.62 33.51,61.62 33.52,61.61 33.63,61.57 33.64,61.56 33.64,61.56 33.65,61.56 33.78,61.45 34.02,61.3 34.15,61.26 34.28,61.25 34.34,61.27 34.36,61.28 34.4,61.25 34.41,61.21 34.42,61.16 34.39,61.12
N$55
  pour Top: 34.41,62.44 34.4,62.44 34.39,62.44 34.39,62.44 34.27,62.43 34.23,62.42 34.35,62.31 34.43,62.25 34.47,62.22 34.47,62.17 34.44,62.13 34.43,62.11 34.41,62.1 34.36,62.1 34.35,62.11 34.33,62.12 34.25,62.19 34.13,62.3 33.93,62.4 33.93,62.4 33.92,62.4 33.92,62.41 33.79,62.49 33.71,62.51 33.71,62.43 33.67,62.39 33.58,62.39 33.55,62.43 33.55,62.59 33.55,62.6 33.55,62.61 33.6,62.74 33.6,62.75 33.61,62.76 33.62,62.77 33.71,62.88 33.72,62.89 33.74,62.9 33.75,62.91 33.91,62.94 33.92,62.95 33.92,62.95 34.05,62.95 34.07,62.94 34.08,62.93 34.18,62.84 34.19,62.83 34.2,62.82 34.21,62.81 34.25,62.7 34.26,62.68 34.26,62.66 34.25,62.64 34.23,62.59 34.24,62.59 34.24,62.59 34.25,62.59 34.25,62.59 34.37,62.6 34.48,62.64 34.57,62.69 34.6,62.75 34.63,62.79 34.68,62.8 34.71,62.78 34.75,62.75 34.76,62.7 34.74,62.67 34.69,62.59 34.69,62.58 34.68,62.57 34.67,62.56 34.56,62.5 34.56,62.5 34.55,62.49 34.55,62.49
N$56
  pour Top: 35.51,58.97 35.51,58.72 35.51,58.71 35.5,58.7 35.41,58.49 35.41,58.48 35.4,58.47 35.39,58.47 35.21,58.29 35.2,58.29 35.19,58.28 35.18,58.28 34.98,58.2 34.97,58.2 34.96,58.19 34.76,58.19 34.74,58.2 34.73,58.21 34.67,58.25 34.63,58.27 34.62,58.31 34.64,58.35 34.64,58.35 34.64,58.35 34.59,58.35 34.55,58.38 34.55,58.61 34.56,58.63 34.57,58.64 34.73,58.86 34.73,58.86 34.74,58.86 34.74,58.86 34.92,59.06 34.93,59.08 34.94,59.08 34.95,59.09 35.14,59.14 35.15,59.15 35.16,59.15 35.18,59.15 35.35,59.12 35.37,59.11 35.38,59.11 35.39,59.09 35.48,59 35.5,58.99
N$57
  pour Top: 36.7,58.23 36.48,57.88 36.26,57.54 36.25,57.52 36.22,57.5 36.07,57.5 36.04,57.54 36.04,57.92 36.02,58.01 36.02,58.02 36.02,58.02 36.02,58.02 36.01,58.08 35.99,58.16 35.99,58.18 35.97,58.21 35.97,58.23 35.97,58.25 35.69,57.9 35.68,57.88 35.66,57.87 35.61,57.87 35.6,57.88 35.58,57.89 35.55,57.92 35.54,57.97 35.57,58 35.92,58.44 35.92,58.44 35.92,58.44 35.92,58.45 35.88,58.51 35.85,58.55 35.86,58.6 35.89,58.62 35.93,58.65 35.98,58.64 36,58.61 36.09,58.49 36.1,58.48 36.11,58.47 36.11,58.45 36.14,58.29 36.14,58.27 36.14,58.26 36.13,58.25 36.13,58.25 36.13,58.24 36.13,58.24 36.14,58.23 36.15,58.19 36.18,58.05 36.2,57.95 36.2,57.94 36.2,57.93 36.2,57.74 36.34,57.97 36.56,58.32 36.59,58.35 36.64,58.37 36.67,58.34 36.71,58.32 36.72,58.27
N$58
  pour Top: 37.35,64.87 37.18,64.85 37.17,64.85 37.17,64.85 36.99,64.85 36.95,64.88 36.95,64.92 36.92,65.15 36.92,65.15 36.92,65.15 36.92,65.36 36.87,65.48 36.81,65.55 36.68,65.61 36.64,65.63 36.62,65.68 36.64,65.72 36.66,65.76 36.7,65.78 36.74,65.76 36.9,65.69 36.91,65.68 36.92,65.68 36.93,65.67 37,65.58 37,65.57 37.01,65.57 37.01,65.56 37.07,65.41 37.08,65.4 37.08,65.39 37.08,65.16 37.1,65.01 37.16,65.01 37.32,65.03 37.44,65.06 37.49,65.07 37.53,65.04 37.55,64.96 37.53,64.91 37.48,64.9 37.36,64.87 37.36,64.87 37.35,64.87
N$59
  pour Top: 38.2,58.15 38.07,58.1 38.06,58.09 38.06,58.09 38.05,58.09 37.83,58.06 37.82,58.06 37.82,58.06 37.69,58.06 37.69,58 37.69,57.99 37.68,57.99 37.65,57.86 37.69,57.86 37.77,57.86 37.88,57.88 37.92,57.89 37.96,57.86 37.97,57.81 37.98,57.77 37.95,57.73 37.91,57.72 37.79,57.7 37.79,57.7 37.78,57.7 37.67,57.7 37.67,57.7 37.66,57.7 37.61,57.71 37.61,57.71 37.61,57.46 38.03,57.51 38.07,57.51 38.11,57.48 38.12,57.44 38.12,57.4 38.09,57.36 38.05,57.35 37.54,57.29 37.54,57.29 37.53,57.29 37.51,57.29 37.49,57.3 37.48,57.31 37.46,57.33 37.45,57.35 37.45,57.72 37.45,57.73 37.45,57.74 37.53,58.02 37.53,58.19 37.56,58.22 37.81,58.22 38.02,58.25 38.13,58.3 38.17,58.32 38.22,58.3 38.24,58.26 38.26,58.22 38.24,58.17
N$60
  pour Top: 38.28,65.09 38.1,64.87 38.08,64.86 38.06,64.85 38.02,64.85 38,64.85 37.99,64.86 37.95,64.89 37.95,64.94 37.98,64.98 38.12,65.15 38.04,65.22 37.92,65.33 37.91,65.34 37.91,65.34 37.9,65.35 37.84,65.47 37.72,65.6 37.68,65.63 37.68,65.68 37.72,65.71 37.75,65.74 37.8,65.74 37.83,65.71 37.97,65.57 37.97,65.56 37.98,65.56 37.98,65.55 38.04,65.44 38.15,65.34 38.2,65.29 38.47,65.77 38.49,65.81 38.53,65.83 38.57,65.81 38.61,65.79 38.63,65.74 38.61,65.7 38.29,65.1 38.28,65.1 38.28,65.1
N$61
  pour Top: 39.3,57.67 39.28,57.63 39.24,57.61 39.2,57.63 38.65,57.81 38.62,57.57 38.62,57.53 38.58,57.5 38.54,57.5 38.54,57.5 38.53,57.5 38.49,57.51 38.46,57.55 38.46,57.59 38.5,57.86 38.46,57.87 38.39,57.85 38.35,57.84 38.3,57.86 38.29,57.91 38.28,57.95 38.3,57.99 38.35,58.01 38.44,58.03 38.45,58.04 38.47,58.04 38.48,58.03 38.52,58.02 38.57,58.4 38.57,58.43 38.6,58.45 38.63,58.46 38.66,58.47 38.69,58.46 38.71,58.43 38.81,58.3 38.81,58.3 38.81,58.29 38.81,58.29 38.93,58.05 39.05,57.89 39.26,57.77 39.3,57.75 39.31,57.71
N$62
  pour Top: 40.25,58.41 40.21,58.36 40.2,58.35 40.19,58.35 40.18,58.34 40.11,58.31 40.1,58.31 40.09,58.3 39.84,58.3 39.84,58.31 39.83,58.31 39.63,58.36 39.6,58.37 39.58,58.39 39.57,58.41 39.54,58.51 39.53,58.54 39.54,58.56 39.56,58.58 39.61,58.65 39.65,58.77 39.63,58.81 39.6,58.83 39.43,58.76 39.3,58.68 39.7,58.14 39.72,58.11 39.71,58.06 39.68,58.03 39.66,58.02 39.65,58.01 39.61,58.01 39.58,58.03 39.57,58.05 39.17,58.59 39.11,58.55 39.08,58.52 39.03,58.53 39,58.57 38.98,58.61 38.99,58.66 39.02,58.68 39.35,58.9 39.35,58.9 39.36,58.9 39.36,58.91 39.58,59 39.6,59.01 39.64,59.01 39.66,58.99 39.74,58.93 39.75,58.92 39.76,58.91 39.77,58.9 39.81,58.8 39.82,58.79 39.82,58.76 39.81,58.74 39.76,58.59 39.76,58.58 39.75,58.57 39.75,58.57 39.71,58.52 39.71,58.5 39.86,58.47 40.06,58.47 40.1,58.48 40.13,58.52 40.16,58.55 40.22,58.55 40.25,58.52 40.28,58.49 40.28,58.44
N$63
  pour Top: 40.21,59.28 40.03,59.14 40.02,59.13 40,59.12 39.96,59.12 39.94,59.13 39.92,59.15 39.89,59.19 39.9,59.24 39.94,59.27 40.14,59.42 40.21,59.51 40.34,59.67 40.37,59.71 40.42,59.72 40.45,59.69 40.49,59.66 40.49,59.61 40.47,59.58 40.34,59.41 40.34,59.41 40.34,59.4 40.33,59.4 40.33,59.39 40.71,58.98 40.74,58.95 40.74,58.9 40.71,58.87 40.69,58.85 40.67,58.85 40.63,58.85 40.61,58.85 40.59,58.87
N$64
  pour Top: 41.81,58.08 41.6,58.01 41.38,57.93 41.28,57.85 41.25,57.69 41.21,57.55 41.13,57.55 41.13,57.66 41.1,57.75 41.07,57.83 41.02,57.88 40.95,57.92 40.89,57.95 40.66,58.01 40.63,58.07 40.69,58.1 40.83,58.13 40.95,58.23 41.04,58.38 41.12,58.57 41.14,58.66 41.17,58.66 41.27,58.37 41.35,58.19 41.54,58.15 41.75,58.13 41.81,58.13
N$65
  pour Top: 41.97,61.97 41.96,61.97 41.95,61.97 41.91,61.97 41.88,62 41.87,62.03 41.83,62.18 41.83,62.19 41.83,62.19 41.83,62.19 41.8,62.39 41.48,62.35 41.53,62.19 41.57,62.1 41.59,62.06 41.57,62.02 41.53,62 41.52,61.99 41.5,61.99 41.46,61.99 41.43,62.01 41.42,62.04 41.38,62.13 41.38,62.13 41.38,62.14 41.38,62.14 41.32,62.33 41.08,62.29 41.1,62.13 41.1,62.13 41.1,62.13 41.1,61.89 41.06,61.86 40.97,61.86 40.94,61.89 40.94,62.12 40.91,62.32 40.91,62.34 40.91,62.36 40.92,62.37 40.95,62.41 40.96,62.43 40.98,62.44 41.01,62.45 41.8,62.55 41.81,62.55 41.82,62.55 41.83,62.55 41.83,62.57 41.84,62.61 41.89,62.64 41.93,62.62 41.97,62.61 42,62.57 41.99,62.53 41.96,62.43 41.99,62.22 42.02,62.07 42.03,62.03 42.01,61.98
N$66
  pour Top: 38.46,58.63 38.46,58.75 38.39,58.9 38.32,59.03 38.27,59.15 38.27,59.32 38.24,59.44 38.17,59.58 38.06,59.7 37.89,59.79 37.71,59.86 37.51,59.95 37.42,60.01 37.38,60.15 37.36,60.24 37.39,60.43 37.49,60.57 37.57,60.69 37.59,60.77 37.59,60.99 37.58,61.09 37.55,61.2 37.47,61.3 37.36,61.39 37.24,61.48 37.13,61.58 36.93,61.66 36.83,61.72 36.7,61.89 36.56,62.04 36.49,62.16 36.37,62.23 36.2,62.35 36.08,62.44 36,62.55 35.96,62.65 35.96,63.06 35.87,63.06 35.82,63.01 35.68,62.92 35.57,62.86 35.39,62.79 35.14,62.79 35.03,62.82 35.07,62.92 35.13,63.02 35.31,63.33 35.39,63.44 35.53,63.6 35.84,63.93 36.05,64.07 36.42,64.29 36.59,64.38 36.66,64.42 36.67,64.3 36.72,64.13 36.79,64.06 36.88,63.97 36.96,63.97 37.01,64.05 37.05,64.15 37.06,64.25 37.2,64.27 37.29,64.27 37.41,64.27 37.41,64.37 37.47,64.42 37.55,64.42 37.62,64.53 37.65,64.67 37.74,64.7 37.8,64.7 37.87,64.71 37.95,64.7 38.07,64.68 38.17,64.64 38.26,64.59 38.21,64.46 38.14,64.38 38.07,64.28 38,64.15 38,64.07 38,63.91 38.03,63.7 38.01,63.7 38.03,63.66 38.04,63.63 38.11,63.51 38.11,63.41 38.08,63.37 37.86,63.37 37.73,63.3 37.71,63.23 37.76,63.1 37.81,63.03 37.82,62.95 37.76,62.81 37.75,62.7 37.77,62.49 37.81,62.41 37.71,62.39 37.58,62.41 37.57,62.38 37.53,62.3 37.56,62.2 37.61,62.16 37.66,62.09 37.66,61.98 37.6,61.9 37.56,61.8 37.6,61.62 37.72,61.52 37.84,61.4 37.94,61.18 37.95,61.12 38.09,61.11 38.26,61.1 38.38,61.03 38.42,60.98 38.46,60.91 38.63,60.88 38.74,60.87 38.84,60.83 38.97,60.71 39.01,60.65 39.03,60.51 38.98,60.37 38.93,60.27 38.85,60.13 38.79,59.94 38.78,59.74 38.78,59.61 38.75,59.43 38.74,59.23 38.8,59.14 38.77,59.01 38.77,58.84 38.77,58.75 38.72,58.72 38.62,58.69 38.5,58.63
N$67
  pour Top: 40.71,62.38 40.55,62.21 40.42,62.1 40.4,62.1 40.3,62.05 40.28,61.82 40.33,61.58 40.38,61.39 40.32,61.29 40.18,61.09 40.12,60.93 40.19,60.75 40.27,60.58 40.38,60.37 40.47,60.56 40.57,60.81 40.64,61.07 40.71,61.37 40.76,61.63 40.76,62.13
N$68
  pour Top: 39.13,64.39 39.29,64.32 39.51,64.17 39.63,64.04 39.7,63.97 39.72,63.93 39.54,63.89 39.42,63.79 39.31,63.73 39.23,63.58 39.04,63.58 38.91,63.69 38.78,63.74 38.57,63.83 38.5,63.94 38.5,64.11 38.59,64.23 38.61,64.32 38.64,64.48
N$69
  pour Top: 34.68,61.97 34.58,61.5 34.58,61.2 34.63,60.78 34.71,60.48 34.89,60.07 35.27,59.47 35.39,59.32 35.7,59.03 35.57,59.36 35.51,59.53 35.51,59.73 35.58,59.96 35.57,60.06 35.46,60.22 35.32,60.36 35.19,60.44 35.11,60.5 35.14,60.66 35.19,60.83 35.2,60.99 35.17,61.1 35.08,61.17 34.95,61.27 34.85,61.4 34.79,61.54 34.75,61.74
N$70
  pour Top: 41.14,63.39 41.36,63.49 41.35,63.5 41.35,63.51 41.35,63.71 41.39,63.74 41.48,63.74 41.51,63.71 41.51,63.54 41.56,63.42 41.56,63.42 41.56,63.41 41.56,63.41 41.6,63.23 41.6,63.22 41.6,63.21 41.6,63.2 41.58,63.05 41.58,63.03 41.57,63.02 41.56,63.01 41.44,62.84 41.43,62.83 41.42,62.82 41.4,62.81 41.2,62.75 41.19,62.74 41.18,62.74 41,62.74 40.99,62.75 40.98,62.75 40.84,62.81 40.83,62.81 40.82,62.82 40.82,62.83 40.68,62.99 40.67,62.99 40.67,62.99 40.67,62.99 40.56,63.14 40.54,63.16 40.54,63.19 40.55,63.21 40.56,63.24 40.58,63.26 40.6,63.26
N$71
  pour Top: 41.15,66.18 40.94,65.79 40.83,65.63 40.66,65.53 40.7,65.45 40.95,65.31 41.13,65.19 41.19,65.05 41.26,65.05 41.29,65.09 41.34,65.33 41.4,65.49 41.63,65.61 41.75,65.71 41.68,65.74 41.62,65.75 41.48,65.79 41.39,65.83 41.27,65.98
PICOW_U0_RX  (via drill 0.51)
  Top 0.203: U1.36 92.55,43.53 93.22,44.2 96.52,44.2 v98.04,42.67
  Top 0.305: M2.2 TP2.P$1 55.37,30.73 54.1,32 R11.2
  Bottom 0.203: v98.04,42.67 98.04,42.93 98.81,43.69 98.81,48.77 93.22,54.36 86.11,54.36 77.22,45.47 63.5,45.47
  Bottom 0.254: 63.5,45.47 58.93,40.89 TP2.P$1
PICOW_U0_TX  (via drill 0.51)
  Top 0.203: U1.37 92.45,43.93 93.22,44.7 97.54,44.7 v98.04,44.2
  Top 0.305: R12.2 58.31,33.89 TP3.P$1 M2.1
  Bottom 0.203: 64.01,44.96 77.47,44.96 86.36,53.85 92.96,53.85 98.3,48.51 98.3,44.45 v98.04,44.2
  Bottom 0.254: 64.01,44.96 63.75,44.96 61.47,42.67 TP3.P$1
PICOW_U1_RX
  Bottom 0.305: M2.12 33.53,35.05 30.48,38.1 26.92,38.1 25.4,39.62 16,39.62 12.19,43.43 12.19,52.07 11.05,53.21 M1.3
PICOW_U1_TX
  Top 0.305: R5.1 4.57,54.36 5.97,55.75 M1.2
  Bottom 0.305: M2.11 36.07,33.78 30.99,38.86 27.43,38.86 25.65,40.64 16.51,40.64 13.21,43.94 13.21,54.1 11.56,55.75 M1.2
R/!W!_5V
  Top 0.203: 64.01,4.79 JP4.8 63.98,4.6 | U4.1 89.6,24.32 87.88,22.61 87.88,21.08 88.39,20.57 88.39,18.54 90.93,16 90.93,13.97 87.63,10.67 76.71,10.67 TP12.P$1
  Top 0.305: 63.98,4.6 65.79,2.79 74.42,2.79 75.69,4.06 75.69,9.65 TP12.P$1
RP_SWCLK  (via drill 0.51)
  Top 0.203: U1.24 89.09,38.93 90.42,37.59 92.2,37.59 92.71,37.08 92.71,36.58 v93.73,35.56
  Top 0.305: R3.1 90.79,56.64 | v89.41,56.64 90.79,56.64 | 90.79,56.64 90.79,57.71 R1.1
  Bottom 0.203: v93.73,35.56 94.74,35.56 100.33,41.15 100.33,50.8 94.23,56.9 89.66,56.9 v89.41,56.64 88.65,55.88 85.34,55.88 76.45,46.99 61.98,46.99 50.04,35.05 50.04,25.4 50.8,24.64 52.58,24.64 M2.4
RP_SWD  (via drill 0.51)
  Top 0.203: U1.25 89.49,39.04 90.42,38.1 92.46,38.1 v93.73,36.83 | R2.1 95,57.91
  Top 0.305: v93.73,56.13 95,56.13 | 95,57.91 95,56.13 | 95,56.13 95,55.21 R4.2
  Bottom 0.203: 93.73,55.37 85.6,55.37 76.71,46.48 62.48,46.48 51.31,35.31 M2.5 | v93.73,36.83 95.25,36.83 99.82,41.4 99.82,49.28 93.73,55.37 | 93.73,55.37 v93.73,56.13
SPARE0_ADC
  Bottom 0.305: M2.32 41.15,8.89 40.64,9.4 37.85,9.4 37.34,8.89 37.34,7.11 36.83,6.6 12.45,6.6 11.43,7.62 11.43,12.7 TP9.P$1
SPARE3
  Top 0.305: M2.21 13.21,9.91 11.43,11.68 TP10.P$1 LED2.C
SPARE4
  Top 0.305: M2.22 15.75,9.91 | 15.75,9.91 15.75,14.73 14.73,15.75 8.38,15.75 TP8.P$1 | LED7.C 24.86,3.84 22.35,6.35 20.83,6.35 19.81,7.37 19.81,9.14 19.05,9.91 15.75,9.91
SPARE5
  Top 0.305: M2.24 20.83,14.73 17.27,18.29 10.92,18.29 TP6.P$1
SPARE6_ADC
  Top 0.305: M2.34 46.23,7.11 47.5,5.84 TP15.P$1
SPI1_CS
  Top 0.203: M2.20 17.27,29.97 17.27,32.26 18.12,33.11 SD1.2
  Top 0.305: SD1.2 21.68,33.11 22.1,33.53 R13.1
SPI1_MISO
  Top 0.203: M2.16 22.1,27.18 20.57,27.18 19.81,26.42 19.81,24.64 19.05,23.88 12.19,23.88 11.18,24.89 11.18,27.43 15.24,31.5 15.24,36.83 17.02,38.61 SD1.7
  Top 0.305: SD1.7 21.85,38.61 22.1,38.35 R9.1
SPI1_MOSI
  Top 0.203: SD1.3 17.7,34.21 16.76,33.27 16.76,30.99 12.19,26.42 12.19,25.4 12.7,24.89 16.26,24.89 16.76,25.4 16.76,26.67 18.8,28.7 24.38,28.7 25.91,27.18 M2.15
SPI1_SCK
  Top 0.203: SD1.5 17.61,36.41 16,34.8 16,31.24 11.68,26.92 11.68,25.15 12.45,24.38 18.8,24.38 19.3,24.89 19.3,26.92 20.32,27.94 23.11,27.94 24.38,26.67 24.38,25.4 25.4,24.38 27.94,24.38 28.45,24.89 M2.14
  Top 0.305: R18.1 26.16,29.72 28.32,27.56 28.32,26.04 M2.14
VBUS
  Top 0.254: M2.40 61.47,7.62 60.71,6.86 58.67,6.86 57.91,7.62 57.91,10.67 60.71,13.46 62.74,13.46 63.18,13.9 Q1.G
VCCB  (via drill 0.51, 0.71)
  Top 0.254: R27.1 76.96,2.79
  Top 0.305: v31.24,4.83 31.24,5.33 30.73,5.84 R26.1 | 63.67,20.86 63.67,21.93 63.25,22.35 60.45,22.35 59.94,21.84 59.94,13.46 57.4,10.92 57.4,3.56 v56.39,2.54 56.9,2.03 76.2,2.03 76.96,2.79
  Top 0.406: 70.46,24.28 U5.20 68.31,25.26 | U7.23 U7.24 94.64,25.25 94.49,25.4 | U4.5 92.2,23.37 91.95,23.62 91.95,25.15 92.2,25.4 | C19.1 93.36,25.51 93.47,25.4 | U6.20 79.86,24.28 80.01,24.13 | 63.67,20.57 63.67,20.86 | C24.1 63.75,20.83 63.75,20.86
  Top 0.61: 70.46,24.28 70.98,23.76 77.98,23.76 | 68.31,25.26 C22.1 C21.1 65.67,25.29 65.28,24.89 65.28,22.35 65.34,22.29 U8.5 63.75,20.86 63.67,20.86 | 94.49,25.4 93.47,25.4 92.2,25.4 88.9,25.4 87.63,24.13 80.01,24.13 79.76,24.13 79.39,23.76 77.98,23.76 | C23.1 77.98,23.76 | C20.1 77.98,23.76
  Bottom 0.305: v31.24,4.83 37.59,4.83 40.39,2.03 55.88,2.03 v56.39,2.54
VCCB_PWR
  Top 0.305: M2.26 25.91,6.35 26.42,5.84 R26.2
VDD_SD
  Top 0.305: C13.1 24.89,34.04 24.53,33.67 R13.2 R15.2 | R8.2 R9.2 25.91,38.35 26.42,37.85 26.42,35.42 26.16,35.16
  Top 0.61: SD1.4 21.08,35.31 21.22,35.16 C12.1 C13.1 26.16,35.16 27.29,35.16 27.37,35.24 U3.1
VLED  (via drill 0.51)
  Top 0.406: v33.78,2.79 34.66,3.67 C27.1 36.94,3.67 37.81,4.54 LED6.1
  Top 0.508: 11.94,4.94 LED5.1 | 11.94,4.87 LED5.1 | LED5.1 11.9,4.36 12.7,3.56 19.3,3.56 19.42,3.44 C28.1 20.94,3.44 v21.59,2.79
  Top 0.61: D2.C 63.87,7.49 62.74,6.35 v62.48,6.35
  Bottom 0.406: v33.78,2.79 33.78,1.27
  Bottom 0.508: v62.48,6.35 58.42,6.35 57.66,5.59 57.66,1.78 57.15,1.27 33.78,1.27 23.11,1.27 v21.59,2.79
VSYS
  Top 0.61: 64.01,10.67 63.87,10.53 D1.C 63.87,10.29 64.77,9.4 65.28,9.4 66.17,8.5 D2.A
  Top 0.813: 62.74,11.94 62.8,12 Q1.S 64.01,11.99 64.01,10.67
  Top 1.27: 62.74,11.94 60.96,11.94 58.93,9.91 M2.39
  Bottom 0.508: M2.39 59.18,8.13
W/!R!
  Top 0.203: U1.39 92.23,44.73 93.22,45.72 98.55,45.72 99.57,44.7 99.57,34.8 103.12,31.24 103.12,24.64 102.36,23.88 95.5,23.88 | U7.2 95.46,20.78 96.01,21.34 96.01,21.84 95.5,22.35 95.5,23.88 | 95.5,23.88 94.49,23.88 94.05,24.32 U4.6
WS2812_DI
  Top 0.254: 42.42,8.64 42.42,6.6 42.96,6.06 LED6.4
  Top 0.305: M2.29 33.53,8.64 34.29,9.4 41.66,9.4 42.42,8.64

## Text on the board
tNames: CK | G | IO | EP SWD | GND | PPS | GPS | GND | GND | 3V3 | UltraMod 4V2a | GND | 3V3 | RX/EPCLK | FLOW | BOOTSEL | EP_SWD_DIS | E | + | github.com/mookiedog/umod4-PCB | GND | + | + | E | R/!W! | + | GND | GND | GND | RST | R/!W! | E | +5 | +5 | BSY | VCCB | + | + | +
bNames: JLCJLCJLCJLC